# Altium project lcd driver.PrjPcb
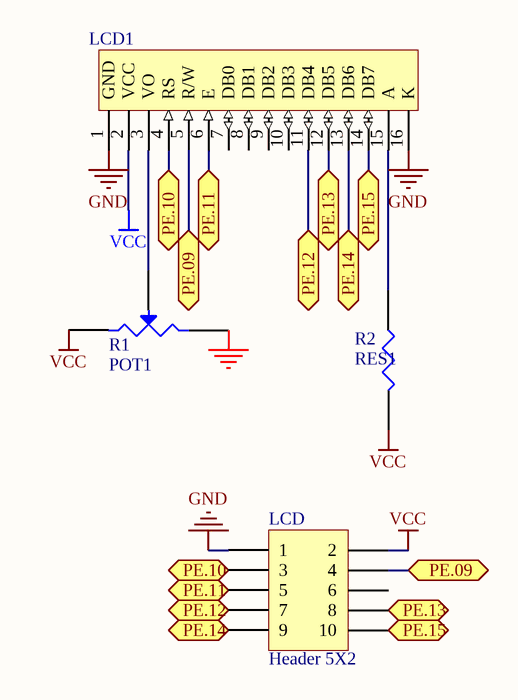
[diagram p0: lcd driver.SchDoc]
1 sheet, 4 parts. Net scope: flat (ports and power ports of the same name join across sheets).
Board file: lcd driver.PcbDoc

## Sheet lcd driver.SchDoc
size A

### Parts
LCD  Header 5X2  [HDR2X5]
LCD1  LCD 16X2  [My_LCD 16x2-A]  (value not drawn)
R1  POT1  [VR4]
R2  RES1  [AXIAL-0.3]

### Ports
PE.09, PE.10, PE.11, PE.12, PE.13, PE.14, PE.15

### Nets
GND: LCD.1 LCD1.1(GND) LCD1.16(K) R1.2
VCC: LCD.2 LCD1.2(VCC) R1.1 R2.2
NetLCD1_3: LCD1.3(VO) R1.3(W)
NetLCD1_15: LCD1.15(A) R2.1
NetLCD_3: LCD.3 LCD1.4(RS) ; port PE.10
NetLCD_4: LCD.4 LCD1.5(R/W) ; port PE.09
NetLCD_5: LCD.5 LCD1.6(E) ; port PE.11
NetLCD_7: LCD.7 LCD1.11(DB4) ; port PE.12
NetLCD_8: LCD.8 LCD1.12(DB5) ; port PE.13
NetLCD_9: LCD.9 LCD1.13(DB6) ; port PE.14
NetLCD_10: LCD.10 LCD1.14(DB7) ; port PE.15

Not connected (* = marked no-connect by the designer): LCD 6; LCD1 7(DB0) 8(DB1) 9(DB2) 10(DB3)

### Library data of the parts
LCD = Header 5X2: Header, 5-Pin, Dual row; LatestRevisionDate: 17-Jul-2002; LatestRevisionNote: Re-released for DXP Platform.; Publisher: Altium Limited
LCD1 = LCD 16X2: LCD 16X2 Character lcd
R1 = POT1: Potentiometer